# EAGLE design SmartWatch-BASIC-TOP (EAGLE 9.6.2)
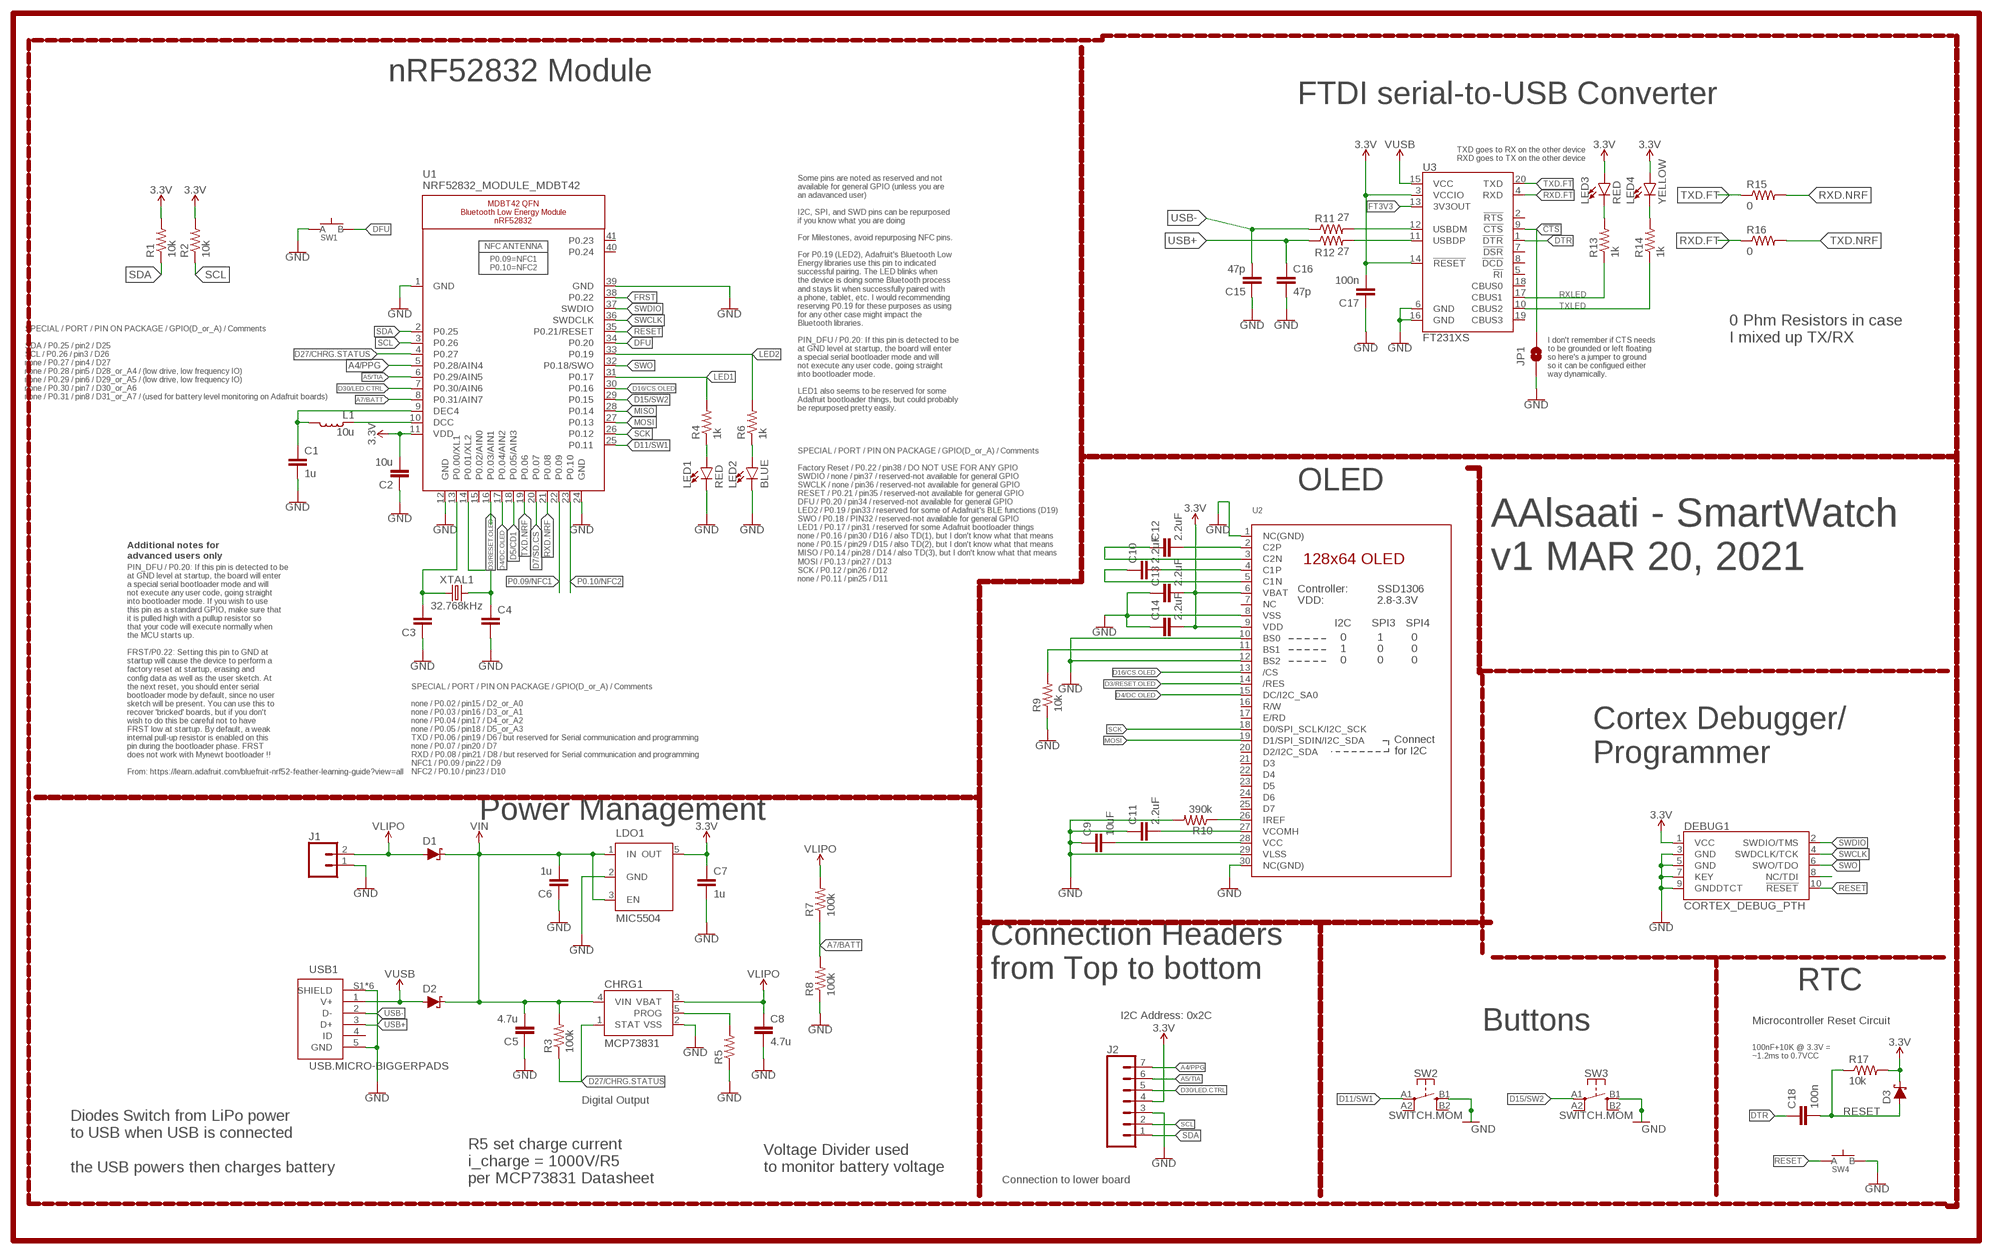
[diagram p0: schematic, sheet 1]

## Parts
C1  1u  CAPACITOR0603  [C0603]
C2  10u  CAPACITOR0805  [C0805]
C3  CAPACITOR0603  [C0603]
C4  CAPACITOR0603  [C0603]
C5  4.7u  CAPACITOR0603  [C0603]
C6  1u  CAPACITOR0603  [C0603]
C7  1u  CAPACITOR0603  [C0603]
C8  4.7u  CAPACITOR0603  [C0603]
C9  10uF  CAPACITOR0603  [C0603]
C10  2.2uF  CAPACITOR0402  [C0402]
C11  2.2uF  CAPACITOR0603  [C0603]
C12  2.2uF  CAPACITOR0402  [C0402]
C13  2.2uF  CAPACITOR0402  [C0402]
C14  2.2uF  CAPACITOR0402  [C0402]
C15  47p  CAPACITOR0603  [C0603]
C16  47p  CAPACITOR0603  [C0603]
C17  100n  CAPACITOR0603  [C0603]
C18  100n  CAPACITOR0603  [C0603]
CHRG1  MCP73831  [SOT23-5]
D1  SCHOTTKY-USC  [USC]
D2  SCHOTTKY-USC  [USC]
D3  SCHOTTKY-USC  [USC]
DEBUG1  CORTEX_DEBUG_PTH  [2X5-PTH-1.27MM]
J1  CONN_02  [1X02]
J2  CONN_07-1.27MM  [1X07_1.27MM]
JP1  JUMPER-SMT_2_NO_SILK  [SMT-JUMPER_2_NO_SILK]
L1  10u  INDUCTOR0603  [L0603]
LDO1  MIC5504  [SOT23-5]
LED1  RED  LED0603  [LED-0603]
LED2  BLUE  LED0603  [LED-0603]
LED3  RED  LED0603  [LED-0603]
LED4  YELLOW  LED0603  [LED-0603]
R1  10k  RESISTOR0603  [R0603]
R2  10k  RESISTOR0603  [R0603]
R3  100k  RESISTOR0603  [R0603]
R4  1k  RESISTOR0603  [R0603]
R5  RESISTOR0603  [R0603]
R6  1k  RESISTOR0603  [R0603]
R7  100k  RESISTOR0603  [R0603]
R8  100k  RESISTOR0603  [R0603]
R9  10k  RESISTOR0603  [R0603]
R10  390k  RESISTOR0603  [R0603]
R11  27  RESISTOR0603  [R0603]
R12  27  RESISTOR0603  [R0603]
R13  1k  RESISTOR0603  [R0603]
R14  1k  RESISTOR0603  [R0603]
R15  0  RESISTOR0603  [R0603]
R16  0  RESISTOR0603  [R0603]
R17  10k  RESISTOR0603  [R0603]
SW1  SPST-PTS830GG140-COPY.1-3  [BUTTON-GULLWING]
SW2  SWITCH.MOM  [TACTILE_SWITCH_SMD_6.2MM_TALL]
SW3  SWITCH.MOM  [TACTILE_SWITCH_SMD_6.2MM_TALL]
SW4  SPST-PTS830GG140-COPY.1-3  [BUTTON-GULLWING]
U1  NRF52832_MODULE_MDBT42  [BLE_MODULE_RAYTAC_MDBT42]
U2  DISP_OLED_UG-2864HSWEG01-NO-WRAPAROUND  [UG-2864HSWEG01_0.96IN_NO-WRAPAROUND]
U3  FT231XS  [SSOP20_L]
USB1  USB.MICRO-BIGGERPADS  [USB-MICRO-01.BIGGERPADS]
XTAL1  32.768kHz  CRYSTALECS-.327-12.5-12-C-TR  [2-SMD.NOLEAD.2.0MMTO1.2MM]

## Nets
3.3V: C2.2 C7.1 C13.2 C14.2 C17.2 D3.-(C) DEBUG1.1(VCC) J2.4 LDO1.5(OUT) LED3.A LED4.A R1.2 R2.2 R17.2 U1.11(VDD) U2.6(VBAT) U2.9(VDD) U3.3(VCCIO) U3.14(!RESET)
!CTS: JP1.2 U3.9(!CTS)
A4/PPG: J2.7 U1.5(P0.28/AIN4)
A5/TIA: J2.6 U1.6(P0.29/AIN5)
A7/BATT: R7.1 R8.2 U1.8(P0.31/AIN7)
D3/RESET.OLED: U1.16(P0.03/AIN1) U2.14(/RES)
D4/DC.OLED: U1.17(P0.04/AIN2) U2.15(DC/I2C_SA0)
D5/CD1: U1.18(P0.05/AIN3)
D7/SD.CS: U1.20(P0.07)
D11/SW1: SW2.A1 U1.25(P0.11)
D15/SW2: SW3.A1 U1.29(P0.15)
D16/CS.OLED: U1.30(P0.16) U2.13(/CS)
D27/CHRG.STATUS: CHRG1.1(STAT) R3.1 U1.4(P0.27)
D30/LED.CTRL: J2.5 U1.7(P0.30/AIN6)
DFU: SW1.3(B) U1.34(P0.20)
DTR: C18.1 U3.1(!DTR)
FRST: U1.38(P0.22)
FT3V3: U3.13(3V3OUT)
GND: C1.2 C2.1 C3.1 C4.2 C5.1 C6.1 C7.2 C8.2 C9.1 C11.1 C13.1 C14.1 C15.1 C16.2 C17.1 CHRG1.2(VSS) DEBUG1.3(GND) DEBUG1.5(GND) DEBUG1.7(KEY) DEBUG1.9(GNDDTCT) J1.1 J2.3 JP1.1 LDO1.2(GND) LED1.C LED2.C R5.1 R8.1 R9.1 R10.2 SW1.1(A) SW2.B1 SW3.B1 SW4.3(B) U1.1(GND) U1.12(GND) U1.24(GND) U1.39(GND) U2.1(NC(GND)) U2.8(VSS) U2.10(BS0) U2.12(BS2) U2.29(VLSS) U2.30(NC(GND)) U3.6(GND) U3.16(GND) USB1.5(GND) USB1.S1(SHIELD) USB1.S2(SHIELD) USB1.S3(SHIELD) USB1.S4(SHIELD) USB1.S5(SHIELD) USB1.S6(SHIELD)
LED1: R4.2 U1.31(P0.17)
LED2: R6.2 U1.33(P0.19)
MISO: U1.28(P0.14)
MOSI: U1.27(P0.13) U2.19(D1/SPI_SDIN/I2C_SDA)
N$1: R9.2 U2.11(BS1)
N$2: R10.1 U2.26(IREF)
N$3: C12.2 U2.2(C2P)
N$4: C3.2 U1.13(P0.00/XL1) XTAL1.P$1
N$5: C12.1 U2.3(C2N)
N$6: C4.1 U1.14(P0.01/XL2) XTAL1.P$2
N$7: C10.2 U2.4(C1P)
N$8: C10.1 U2.5(C1N)
N$9: LED1.A R4.1
N$10: LED2.A R6.1
N$11: L1.1 U1.10(DCC)
N$12: C1.1 L1.2 U1.9(DEC4)
N$13: C9.2 U2.28(VCC)
N$14: DEBUG1.8(NC/TDI)
N$15: C11.2 U2.27(VCOMH)
N$16: CHRG1.5(PROG) R5.2
N$23: R11.2 U3.12(USBDM)
N$24: R12.2 U3.11(USBDP)
N$25: LED3.C R13.2
N$26: LED4.C R14.2
P0.09/NFC1: U1.22(P0.09)
P0.10/NFC2: U1.23(P0.10)
RESET: C18.2 D3.+(A) DEBUG1.10(!RESET) R17.1 SW4.1(A) U1.35(P0.21/RESET)
RXD.FT: R16.1 U3.4(RXD)
RXD.NRF: R15.2 U1.21(P0.08)
RXLED: R13.1 U3.17(CBUS1)
SCK: U1.26(P0.12) U2.18(D0/SPI_SCLK/I2C_SCK)
SCL: J2.2 R2.1 U1.3(P0.26)
SDA: J2.1 R1.1 U1.2(P0.25)
SWCLK: DEBUG1.4(SWDCLK/TCK) U1.36(SWDCLK)
SWDIO: DEBUG1.2(SWDIO/TMS) U1.37(SWDIO)
SWO: DEBUG1.6(SWO/TDO) U1.32(P0.18/SWO)
TXD.FT: R15.1 U3.20(TXD)
TXD.NRF: R16.2 U1.19(P0.06)
TXLED: R14.1 U3.10(CBUS2)
USB+: C16.1 R12.1 USB1.3(D+)
USB-: C15.2 R11.1 USB1.2(D-)
V_USB: D2.+(A) U3.15(VCC) USB1.1(V+) ; supply symbol labelled VUSB
VIN: C5.2 C6.2 CHRG1.4(VIN) D1.-(C) D2.-(C) LDO1.1(IN) LDO1.3(EN) R3.2
VLIPO: C8.1 CHRG1.3(VBAT) D1.+(A) J1.2 R7.2
Unconnected: SW2.A2 SW2.B2 SW3.A2 SW3.B2 U1.15(P0.02/AIN0) U1.40(P0.24) U1.41(P0.23) U2.7(NC) U2.16(R/W) U2.17(E/RD) U2.20(D2/I2C_SDA) U2.21(D3) U2.22(D4) U2.23(D5) U2.24(D6) U2.25(D7) U3.2(!RTS) U3.5(!RI) U3.7(!DSR) U3.8(!DCD) U3.18(CBUS0) U3.19(CBUS3) USB1.4(ID)

## Notes on the sheet
- nRF52832 Module
- FTDI serial-to-USB Converter
- TXD goes to RX on the other device
  RXD goes to TX on the other device
- 0 Phm Resistors in case 
  I mixed up TX/RX
- I don't remember if CTS needs
  to be grounded or left floating
  so here's a jumper to ground
  so it can be configued either
  way dynamically.
- SPECIAL / PORT / PIN ON PACKAGE / GPIO(D_or_A) / Comments
  
  SDA / P0.25 / pin2 / D25
  SCL / P0.26 / pin3 / D26
  none / P0.27 / pin4 / D27
  none / P0.28 / pin5 / D28_or_A4 / (low drive, low frequency IO)
  none / P0.29 / pin6 / D29_or_A5 / (low drive, low frequency IO)
  none / P0.30 / pin7 / D30_or_A6
  none / P0.31 / pin8 / D31_or_A7 / (used for battery level monitoring on Adafruit boards)
- Some pins are noted as reserved and not
  available for general GPIO (unless you are
  an adavanced user)
  
  I2C, SPI, and SWD pins can be repurposed
  if you know what you are doing
  
  For Milestones, avoid repurposing NFC pins.
  
  For P0.19 (LED2), Adafruit's Bluetooth Low
  Energy libraries use this pin to indicated
  successful pairing. The LED blinks when
  the device is doing some Bluetooth process
  and stays lit when successfully paired with
  a phone, tablet, etc. I would recommending
  reserving P0.19 for these purposes as using
  for any other case might impact the
  Bluetooth libraries.
  
  PIN_DFU / P0.20: If this pin is detected to be
  at GND level at startup, the board will enter
  a special serial bootloader mode and will
  not execute any user code, going straight
  into bootloader mode.
  
  LED1 also seems to be reserved for some
  Adafruit bootloader things, but could probably
  be repurposed pretty easily.
- OLED
- Additional notes for
  advanced users only
- AAlsaati - SmartWatch 
  v1 MAR 20, 2021
- SPECIAL / PORT / PIN ON PACKAGE / GPIO(D_or_A) / Comments
  
  Factory Reset / P0.22 / pin38 / DO NOT USE FOR ANY GPIO
  SWDIO / none / pin37 / reserved-not available for general GPIO
  SWCLK / none / pin36 / reserved-not available for general GPIO
  RESET / P0.21 / pin35 / reserved-not available for general GPIO
  DFU / P0.20 / pin34 / reserved-not available for general GPIO
  LED2 / P0.19 / pin33 / reserved for some of Adafruit's BLE functions (D19)
  SWO / P0.18 / PIN32 / reserved-not available for general GPIO
  LED1 / P0.17 / pin31 / reserved for some Adafruit bootloader things
  none / P0.16 / pin30 / D16 / also TD(1), but I don't know what that means
  none / P0.15 / pin29 / D15 / also TD(2), but I don't know what that means
  MISO / P0.14 / pin28 / D14 / also TD(3), but I don't know what that means
  MOSI / P0.13 / pin27 / D13
  SCK / P0.12 / pin26 / D12
  none / P0.11 / pin25 / D11
- Cortex Debugger/
  Programmer
- PIN_DFU / P0.20: If this pin is detected to be
  at GND level at startup, the board will enter
  a special serial bootloader mode and will
  not execute any user code, going straight
  into bootloader mode. If you wish to use
  this pin as a standard GPIO, make sure that
  it is pulled high with a pullup resistor so
  that your code will execute normally when
  the MCU starts up.
  
  FRST/P0.22: Setting this pin to GND at
  startup will cause the device to perform a
  factory reset at startup, erasing and
  config data as well as the user sketch. At
  the next reset, you should enter serial
  bootloader mode by default, since no user
  sketch will be present. You can use this to
  recover 'bricked' boards, but if you don't
  wish to do this be careful not to have
  FRST low at startup. By default, a weak
  internal pull-up resistor is enabled on this
  pin during the bootloader phase. FRST
  does not work with Mynewt bootloader !!
  
  From: https://learn.adafruit.com/bluefruit-nrf52-feather-learning-guide?view=all
- SPECIAL / PORT / PIN ON PACKAGE / GPIO(D_or_A) / Comments
  
  none / P0.02 / pin15 / D2_or_A0
  none / P0.03 / pin16 / D3_or_A1
  none / P0.04 / pin17 / D4_or_A2
  none / P0.05 / pin18 / D5_or_A3
  TXD / P0.06 / pin19 / D6 / but reserved for Serial communication and programming
  none / P0.07 / pin20 / D7
  RXD / P0.08 / pin21 / D8 / but reserved for Serial communication and programming
  NFC1 / P0.09 / pin22 / D9
  NFC2 / P0.10 / pin23 / D10
- Power Management
- Connection Headers
  from Top to bottom
- RTC
- I2C Address: 0x2C
- Microcontroller Reset Circuit
- Buttons
- 100nF+10K @ 3.3V =
  ~1.2ms to 0.7VCC
- Digital Output
- Diodes Switch from LiPo power 
  to USB when USB is connected
  
  the USB powers then charges battery
- Voltage Divider used 
  to monitor battery voltage
- R5 set charge current
  i_charge = 1000V/R5
  per MCP73831 Datasheet
- Connection to lower board

## Library data of the parts
C1-C18 = LinnesLab-Passives:CAPACITOR
CHRG1 = LinnesLab-Power:MCP73831: MCP73831T Li-Ion, Li-Pol Controller Miniature single cell, fully integrated Li-Ion, Li-polymer charge management controller Datasheet <http://ww1.microchip.com/downloads/en/DeviceDoc/20001984g.pdf> SparkFun Products: SparkFun ESP32 Thing <https://www.sparkfun.com/products/13907> SparkFun 9DoF Razor IMU M0 <https://www.sparkfun.com/products/14001>; PROD_ID: IC-09995
D1-D3 = LinnesLab-DiscreteSemi:SCHOTTKY: Schottky diode A Schottky diode is a semiconductor diode which has a low forward voltage drop and a very fast switching action. Example: Digi-Key Part Number: RB161MM-20CT-ND
DEBUG1 = LinnesLab-Connectors:CORTEX_DEBUG: Cortex Debug Connector - 10 pin Supports JTAG debug, Serial Wire debug, and Serial Wire Viewer. PTH and SMD connector options available. General Connector Information <http://infocenter.arm.com/help/topic/com.arm.doc.faqs/attached/13634/cortex_debug_connectors.pdf> Products: PTH Connector <http://www.digikey.com/product-detail/en/cnc-tech/3220-10-0100-00/1175-1627-ND/3883661> -via Digi-Key SparkFun PSoc <https://www.sparkfun.com/products/13229> SparkFun T <https://www.sparkfun.com/products/13810>
J1 = LinnesLab-Connectors:CONN_02: Multi connection point. Often used as Generic Header-pin footprint for 0.1 inch spaced/style header connections On any of the 0.1 inch spaced packages, you can populate with these: Break Away Headers - Straight <https://www.sparkfun.com/products/116> (PRT-00116) Break Away Male Headers - Right Angle <https://www.sparkfun.com/products/553> (PRT-00553) Female Headers <https://www.sparkfun.com/products/115> (PRT-00115) Break Away Headers - Machine Pin <https://www.sparkfun.com/products/117> (PRT-00117) Break Away Female Headers - Swiss Machine Pin <https://www.sparkfun.com/products/743> (PRT-00743) For SCREWTERMINALS and SPRING TERMINALS visit here: Screw Terimnals on SparkFun.com <https://www.sparkfun.com/search/results?term=Screw+Terminals> (5mm/3.5mm/2.54mm spacing) This device is also useful as a general connection point to wire up your design to another part of your project. Our various solder wires solder well into these plated through hole pads. Hook-Up Wire - Assortment (Stranded, 22 AWG) <https://www.sparkfun.com/products/11375> (PRT-11375) Hook-Up Wire - Assortment (Solid Core, 22 AWG) <https://www.sparkfun.com/products/11367> (PRT-11367) View the entire wire category on our website here <https://www.sparkfun.com/categories/141> Special notes: Molex polarized connector foot print use with: PRT-08233 with associated crimp pins and housings. 2.54_SCREWTERM for use with PRT-10571. 3.5mm Screw Terminal footprints for PRT-08084 5mm Screw Terminal footprints for use with PRT-08432
J2 = LinnesLab-Connectors:CONN_07: Multi connection point. Often used as Generic Header-pin footprint for 0.1 inch spaced/style header connections On any of the 0.1 inch spaced packages, you can populate with these: Break Away Headers - Straight <https://www.sparkfun.com/products/116> (PRT-00116) Break Away Male Headers - Right Angle <https://www.sparkfun.com/products/553> (PRT-00553) Female Headers <https://www.sparkfun.com/products/115> (PRT-00115) Break Away Headers - Machine Pin <https://www.sparkfun.com/products/117> (PRT-00117) Break Away Female Headers - Swiss Machine Pin <https://www.sparkfun.com/products/743> (PRT-00743) For SCREWTERMINALS and SPRING TERMINALS visit here: Screw Terimnals on SparkFun.com <https://www.sparkfun.com/search/results?term=Screw+Terminals> (5mm/3.5mm/2.54mm spacing) This device is also useful as a general connection point to wire up your design to another part of your project. Our various solder wires solder well into these plated through hole pads. Hook-Up Wire - Assortment (Stranded, 22 AWG) <https://www.sparkfun.com/products/11375> (PRT-11375) Hook-Up Wire - Assortment (Solid Core, 22 AWG) <https://www.sparkfun.com/products/11367> (PRT-11367) View the entire wire category on our website here <https://www.sparkfun.com/categories/141> Special notes: Molex polarized connector foot print use with SKU : PRT-08231 with associated crimp pins and housings. 1MM SMD Version SKU: PRT-10208 NOTES ON THE VARIANTS LOCK and LOCK_LONGPADS... This footprint was designed to help hold the alignment of a through-hole component (i.e. 6-pin header) while soldering it into place. You may notice that each hole has been shifted either up or down by 0.005 of an inch from it's more standard position (which is a perfectly straight line). This slight alteration caused the pins (the squares in the middle) to touch the edges of the holes. Because they are alternating, it causes a "brace" to hold the component in place. 0.005 has proven to be the perfect amount of "off-center" position when using our standard breakaway headers. Although looks a little odd when you look at the bare footprint, once you have a header in there, the alteration is very hard to notice. Also,if you push a header all the way into place, it is covered up entirely on the bottom side.
JP1 = LinnesLab-Switches:JUMPER-SMT_2_NO: Normally open jumper This jumper has two pads in close proximity to each other. Apply solder to close the connection. Round pads are easier to solder for beginners, but are a lot larger. SparkFun Product that uses the round pads: SparkFun EL Sequencer <https://www.sparkfun.com/products/12781>
L1 = LinnesLab-Passives:INDUCTOR
LDO1 = LinnesLab-Power:MIC5504: MIC5504 Voltage Regulator Output Voltages: 1.0V to 3.3V Input Voltages: 2.5V to 5.5V Link to Datasheet http://ww1.microchip.com/downloads/en/DeviceDoc/MIC550X.pdf
LED1-LED4 = LinnesLab-LED:LED: LED (Generic) Standard schematic elements and footprints for 5mm, 3mm, 1206, and 0603 sized LEDs. Generic LEDs with no color specified. LTST-C190KGKT: arrow indicates cathode
R1-R17 = LinnesLab-Passives:RESISTOR
SW1 SW4 = LinnesLab-Switches:SPST-PTS830GG140-COPY
SW2 SW3 = LinnesLab-Switches:SWITCH.MOM: PTS645SM43SMTR92 LFS
U1 = LinnesLab-Microcontrollers:NRF52832_MODULE_MDBT42: MDBT42 - BLE Module (nRF52832 QFN) VDD: 1.7-3.6V
U2 = LinnesLab-Displays:DISP_OLED_UG-2864HSWEG01: UG-2864HSWEG01 OLED display Both 1.3" and 0.96" models share the same FPC tab footprint, only the screen dimensions vary.
U3 = LinnesLab-DigitalIC:FT231X: FTDI FT231X Full Speed USB to Full-handshake UART This USB2.0 Full Speed IC offers a compact bridge to full handshake UART interfaces. The device is a UART, capable of operating up to 3MBaud, with low power consumption (8mA). The FT231X includes the complete FT-X series feature set and enables USB to be added into a system design quickly and easily over a UART interface. Datasheet <http://cdn.sparkfun.com/datasheets/Components/General%20IC/DS_FT231X.pdf>; DIGIKEY: 768-1156-5-ND; MFN: FT231XS-U
USB1 = LinnesLab-Connectors:USB.MICRO: DigiKey PN: 609-4613-1-ND
XTAL1 = LinnesLab-Clocks:CRYSTAL; DIGIKEY: XC2288CT-ND; FREQ: 32.7680KHZ; LOAD_CAP: 12.5pF

## Board
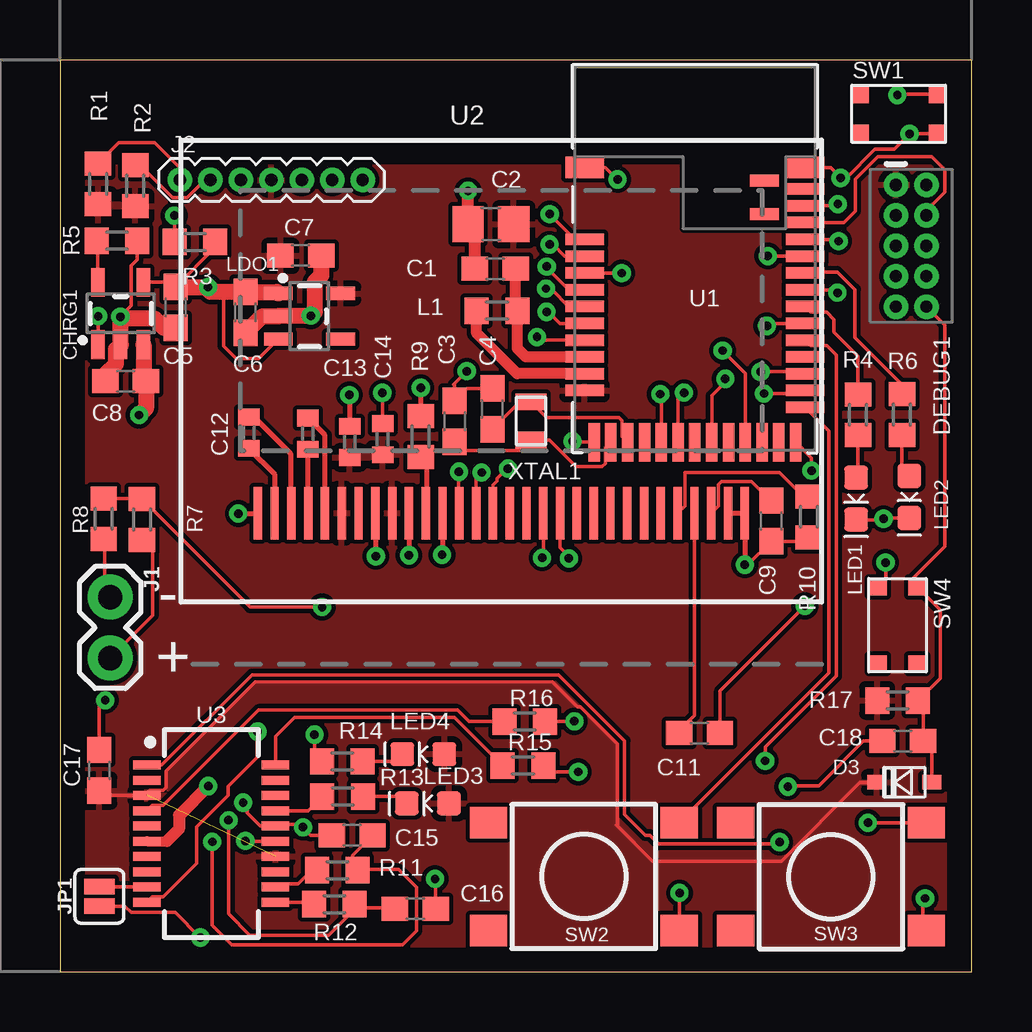
[diagram p1: board, top side]
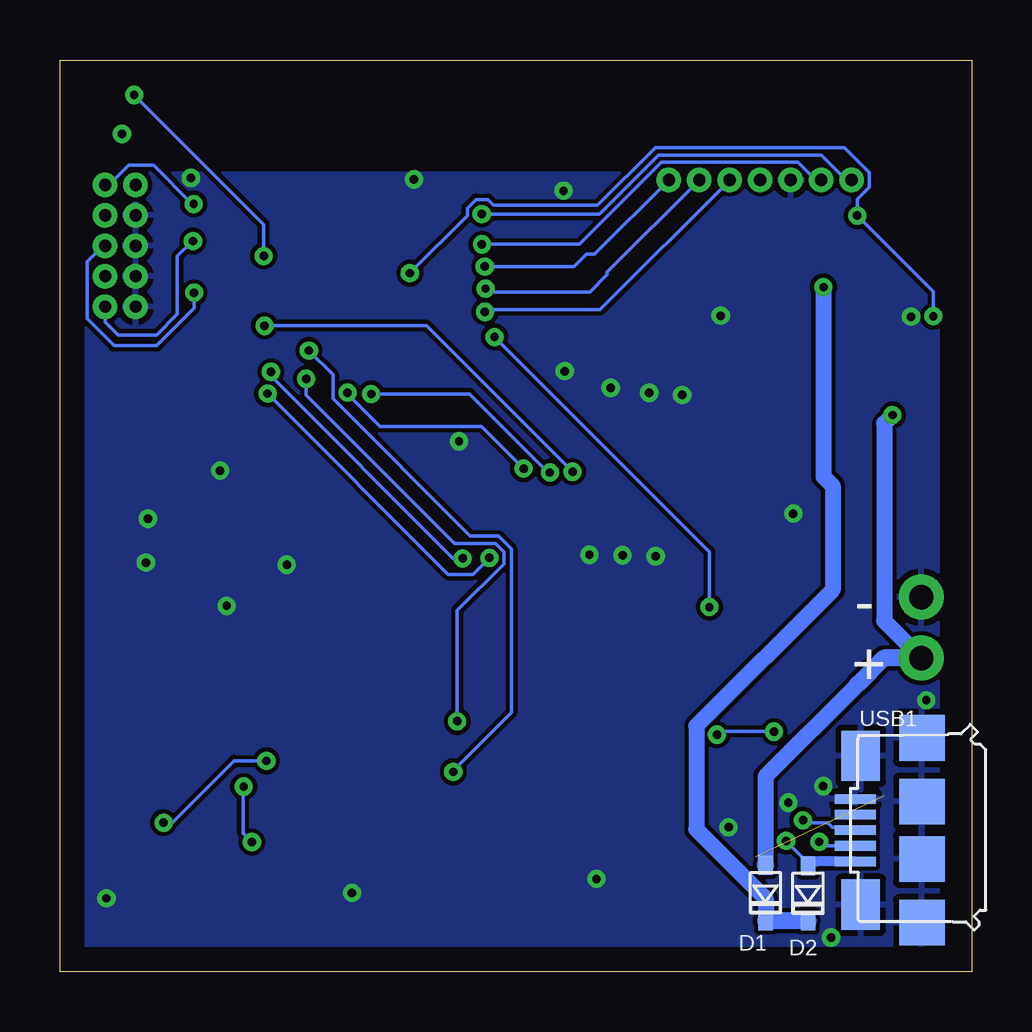
[diagram p2: board, bottom side, seen from below]

Size 38 x 38 mm. Coordinates in mm from the lower left corner, seen from the top.
Outline: 0,0 38,0 38,38 0,38 0,0
Copper layers (1*16): Top 0.035mm / dielectric 1.5mm / Bottom 0.035mm
Design rules "default": minimum track width 6mil, minimum drill 0.35mm, track to track 6mil, track to pad 6mil, pad to pad 6mil, via to via 6mil, smd to smd 6mil, copper to edge 40mil, drill to drill 6mil, minimum pad ring 10mil, minimum via ring 8mil, stop-mask expansion 4mil, vias tented up to drill 0mil, thermal gap 10mil

### Footprints (pad centres in the part's own frame; a part is rotated, then mirrored left to right if it is on the bottom)
C0603 = smd 1.1 x 1: 1 -0.85,0; 2 0.85,0
C0805 = smd 1.3 x 1.5: 1 -0.95,0; 2 0.95,0
C0402 = smd 0.7 x 0.9: 1 -0.65,0; 2 0.65,0
SOT23-5 = smd 0.55 x 1.2: 1 -0.95,-1.3; 2 0,-1.3; 3 0.95,-1.3; 4 0.95,1.3; 5 -0.95,1.3
USC = smd 0.8 x 0.6: + -1.15,0; - 1.15,0
2X5-PTH-1.27MM = drill 0.508 pad 1: 1 -2.54,-0.635; 2 -2.54,0.635; 3 -1.27,-0.635; 4 -1.27,0.635; 5 0,-0.635; 6 0,0.635; 7 1.27,-0.635; 8 1.27,0.635; 9 2.54,-0.635; 10 2.54,0.635
1X02 = drill 1.016 pad 1.88: 1 0,0; 2 2.54,0
1X07_1.27MM = drill 0.508 pad 1: 1 0,0; 2 1.27,0; 3 2.54,0; 4 3.81,0; 5 5.08,0; 6 6.35,0; 7 7.62,0
SMT-JUMPER_2_NO_SILK = smd 0.635 x 1.27: 1 -0.406,0; 2 0.406,0
L0603 = smd 1 x 1.1: 1 -0.85,0; 2 0.85,0
LED-0603 = smd 1 x 1: A -0.877,0; C 0.877,0
R0603 = smd 1 x 1.1: 1 -0.85,0; 2 0.85,0
BUTTON-GULLWING = smd 0.7 x 0.75: 1 -1.6,0.825; 2 1.6,0.825; 3 -1.6,-0.825; 4 1.6,-0.825
TACTILE_SWITCH_SMD_6.2MM_TALL = smd 1.55 x 1.3: A1 -3.975,-2.25; A2 3.975,-2.25; B1 -3.975,2.25; B2 3.975,2.25
BLE_MODULE_RAYTAC_MDBT42 = smd 1.6 x 0.9: 1 -4.6,3.8; 39 4.6,3.8 | smd 1.6 x 0.48: 2 -4.6,0.8; 3 -4.6,0.1; 4 -4.6,-0.6; 5 -4.6,-1.3; 6 -4.6,-2; 7 -4.6,-2.7; 8 -4.6,-3.4; 9 -4.6,-4.1; 10 -4.6,-4.8; 11 -4.6,-5.5; 25 4.6,-6.2; 26 4.6,-5.5; 27 4.6,-4.8; 28 4.6,-4.1; 29 4.6,-3.4; 30 4.6,-2.7; 31 4.6,-2; 32 4.6,-1.3; 33 4.6,-0.6; 34 4.6,0.1; 35 4.6,0.8; 36 4.6,1.5; 37 4.6,2.2; 38 4.6,2.9 | smd 0.48 x 1.6: 12 -4.2,-7.65; 13 -3.5,-7.65; 14 -2.8,-7.65; 15 -2.1,-7.65; 16 -1.4,-7.65; 17 -0.7,-7.65; 18 0,-7.65; 19 0.7,-7.65; 20 1.4,-7.65; 21 2.1,-7.65; 22 2.8,-7.65; 23 3.5,-7.65; 24 4.2,-7.65 | smd 1.2 x 0.5: 40 2.9,3.25; 41 2.9,1.85
UG-2864HSWEG01_0.96IN_NO-WRAPAROUND = smd 0.35 x 2.2: 1 -10.15,-1.2; 2 -9.45,-1.2; 3 -8.75,-1.2; 4 -8.05,-1.2; 5 -7.35,-1.2; 6 -6.65,-1.2; 7 -5.95,-1.2; 8 -5.25,-1.2; 9 -4.55,-1.2; 10 -3.85,-1.2; 11 -3.15,-1.2; 12 -2.45,-1.2; 13 -1.75,-1.2; 14 -1.05,-1.2; 15 -0.35,-1.2; 16 0.35,-1.2; 17 1.05,-1.2; 18 1.75,-1.2; 19 2.45,-1.2; 20 3.15,-1.2; 21 3.85,-1.2; 22 4.55,-1.2; 23 5.25,-1.2; 24 5.95,-1.2; 25 6.65,-1.2; 26 7.35,-1.2; 27 8.05,-1.2; 28 8.75,-1.2; 29 9.45,-1.2; 30 10.15,-1.2
SSOP20_L = smd 0.381 x 1.143: 1 -2.857,-2.68; 2 -2.223,-2.68; 3 -1.587,-2.68; 4 -0.953,-2.68; 5 -0.318,-2.68; 6 0.318,-2.68; 7 0.953,-2.68; 8 1.587,-2.68; 9 2.223,-2.68; 10 2.857,-2.68; 11 2.857,2.68; 12 2.223,2.68; 13 1.587,2.68; 14 0.953,2.68; 15 0.318,2.68; 16 -0.318,2.68; 17 -0.953,2.68; 18 -1.587,2.68; 19 -2.223,2.68; 20 -2.857,2.68
USB-MICRO-01.BIGGERPADS = smd 0.4 x 1.7: 1 -1.3,1.505; 2 -0.65,1.505; 3 0,1.505; 4 0.65,1.505; 5 1.3,1.505 | smd 1.9 x 1.9: S1 -3.85,-1.27; S2 -1.2,-1.27; S3 1.2,-1.27; S4 3.85,-1.27 | smd 2.1 x 1.6: S5 -3.1,1.28; S6 3.1,1.28
2-SMD.NOLEAD.2.0MMTO1.2MM = smd 0.7 x 1.3: P$1 -0.8,0; P$2 0.8,0

### Placement (x,y rotation side)
C1  18.15,29.29 180 top
C2  17.96,31.15 0 top
C3  16.44,22.94 270 top
C4  18.03,23.45 90 top
C5  4.83,27.69 90 top
C6  7.74,27.48 90 top
C7  10.04,29.84 0 top
C8  2.74,24.62 180 top
C9  29.65,18.79 90 top
C10  10.34,22.42 270 top
C11  26.66,9.94 180 top
C12  7.87,22.46 270 top
C13  12.08,22.08 270 top
C14  13.45,22.19 270 top
C15  12.18,5.67 0 top
C16  14.81,2.62 0 top
C17  1.64,8.39 270 top
C18  35.13,9.61 0 top
CHRG1  2.53,27.43 0 top
D1  8.59,3.28 270 bottom
D2  6.82,3.26 270 bottom
D3  35.2,7.89 180 top
DEBUG1  35.48,30.25 270 top
J1  2.1,15.61 270 top
J2  5,33 0 top
JP1  1.64,3.13 90 top
L1  18.21,27.54 0 top
LDO1  10.4,27.32 270 top
LED1  33.19,19.72 270 top
LED2  35.41,19.78 270 top
LED3  15.34,7.01 180 top
LED4  15.14,9.06 180 top
R1  1.59,32.84 270 top
R2  3.14,32.76 270 top
R3  5.63,30.41 0 top
R4  33.27,23.21 90 top
R5  2.38,30.46 180 top
R6  35.1,23.22 90 top
R7  3.42,18.84 270 top
R8  1.82,18.88 90 top
R9  15.04,22.3 270 top
R10  31.22,18.95 270 top
R11  11.56,4.22 180 top
R12  11.44,2.81 180 top
R13  11.79,7.3 0 top
R14  11.77,8.76 0 top
R15  19.31,8.59 0 top
R16  19.37,10.42 0 top
R17  34.92,11.3 180 top
SW1  34.97,35.76 180 top
SW2  21.84,3.96 180 top
SW3  32.14,3.95 180 top
SW4  34.91,14.44 270 top
U1  26.47,29.72 0 top
U2  18.4,20.3 0 top
U3  6.31,5.75 270 top
USB1  3.34,5.89 90 bottom
XTAL1  19.64,22.95 90 top

### Tracks (layer width: path | path; a pad name or v marks a point on that pad's centre or on a via)
3.3V  (1 unrouted)
  Top 0.152: U3.3 3.52,7.34 | 3.52,7.34 1.85,7.34 C17.2 | D3.- 33.35,7.89 30.06,4.6 24.7,4.6 23.23,6.07 | 23.23,6.07 23.19,6.11 | 3.52,7.34 3.74,7.55 4.29,7.55 4.43,7.69 4.43,8.36 8.14,12.06 20.54,12.06 21.57,11.04 21.69,11.04 23.23,9.5 23.23,6.07
  pour Top (isolate 0.178): 1.25,33.57 37.75,33.57 37.75,0.35 0.93,0.35 0.93,32.29
!CTS
  Top 0.152: JP1.2 1.66,3.53 U3.9
A4/PPG  (via drill 0.35)
  Top 0.152: U1.5 21.19,28.42 20.3,29.31 v20.3,29.39
  Bottom 0.152: J2.7 15.72,29.9 16.05,29.9 16.57,29.39 v20.3,29.39
A5/TIA  (via drill 0.35)
  Top 0.152: U1.6 21.2,27.72 20.52,28.4 20.5,28.38 20.35,28.38 v20.26,28.47
  Bottom 0.152: J2.6 15.2,29.15 15.2,29.05 15.91,28.33 20.12,28.33 v20.26,28.47
A7/BATT  (via drill 0.35)
  Top 0.152: U1.8 20.02,26.32 v19.89,26.45 | v10.93,15.19 7.92,15.19 R7.1 3.38,19.73 R8.2
  Bottom 0.152: v19.89,26.45 10.93,17.5 v10.93,15.19
D3/RESET.OLED  (via drill 0.35)
  Top 0.152: U2.14 17.35,20.57 v17.57,20.8 | v25.03,24.07 25.07,24.03 U1.16
  Bottom 0.152: v17.57,20.8 17.61,20.76 20.93,24.07 v25.03,24.07
D4/DC.OLED  (via drill 0.35)
  Top 0.152: U2.15 18.05,20.27 18.22,20.45 18.22,20.56 18.65,20.99 v18.67,20.96 | v26.02,24.13 25.77,23.88 U1.17
  Bottom 0.152: v26.02,24.13 26.02,24.07 24.67,22.72 20.43,22.72 v18.67,20.96
D11/SW1
  Top 0.152: SW2.A1 32.05,12.45 32.05,22.54 U1.25
D15/SW2  (via drill 0.35)
  Top 0.152: SW3.A1 v33.68,6.21 | U1.29 31.3,26.09 31.96,26.09 32.35,25.7 32.35,12.32 29.4,9.36 v29.4,8.78
  Bottom 0.152: v33.68,6.21 33.32,6.21 30.74,8.78 v29.4,8.78
D16/CS.OLED  (via drill 0.35)
  Top 0.152: U2.13 16.61,19.14 16.61,20.82 v16.63,20.84 | v29.47,26.92 29.57,27.02 U1.30
  Bottom 0.152: v16.63,20.84 22.71,26.92 v29.47,26.92
D27/CHRG.STATUS  (via drill 0.35)
  Top 0.152: R3.1 4.78,31.5 v4.76,31.51 | v1.59,27.32 1.59,26.14 CHRG1.1 | U1.4 v23.41,29.12 v23.42,29.11
  Bottom 0.152: v1.59,27.32 1.59,28.35 v4.76,31.51 4.76,32.2 4.26,32.7 4.26,33.3 5.3,34.35 13.18,34.35 15.59,31.94 19.92,31.94 20.16,32.18 20.66,32.18 21.02,31.83 21.02,31.51 v23.42,29.11
D30/LED.CTRL  (via drill 0.35)
  Top 0.152: U1.7 20.85,27.02 20.37,27.5 v20.28,27.5
  Bottom 0.152: v20.28,27.5 20.2,27.59 15.49,27.59 J2.5
DFU  (via drill 0.35)
  Top 0.152: U1.34 31.06,29.83 v29.51,29.83 | v34.91,36.54 34.95,36.58 SW1.3
  Bottom 0.152: v29.51,29.83 29.51,31.14 v34.91,36.54
DTR  (via drill 0.35)
  Top 0.152: U3.1 4.25,8.61 8.01,12.37 20.79,12.37 23.54,9.62 23.54,6.55 24.4,5.68 24.6,5.68 24.95,5.33 30.07,5.33 v30,5.39 | v30.34,7.71 30.38,7.75 31.63,7.75 33.49,9.61 C18.1
  Bottom 0.152: v30,5.39 30.36,5.76 30.36,7.69 v30.34,7.71
GND  (via drill 0.35)
  Top 0.152: R8.1 1.86,17.99 1.86,15.85 J1.1 | C4.2 16.96,24.3 C3.1 16.44,24.45 16.41,24.48 v16.96,25.02 | U1.12 21.37,22.07 v21.37,22.11 | R10.2 31.05,17.94 C9.1 28.67,16.96 v28.55,16.96 | 35.35,18.85 LED2.C 35.4,18.9 34.33,18.9 v34.33,18.87 34.21,18.87 34.17,18.83 33.2,18.83 LED1.C | SW3.B1 35.98,1.84 35.98,2.97 v36.06,3.05 | U1.24 31.33,21.41 v31.33,20.88 | SW1.1 v35.43,34.93 v35.42,34.92 34.77,34.27 33.97,34.27 32.77,33.08 v32.54,33.08 32.54,33.12 32.14,33.52 U1.39 | C11.1 27.51,11.7 v31.05,15.24 | SW2.B1 25.82,3.26 v25.83,3.28 | v1.89,11.31 1.64,11.06 C17.1 | v7.64,7.04 7.8,6.88 7.8,6.61 8.34,6.07 U3.16 9.06,6.14 9.97,6.14 10.1,6.01 | SW4.3 34.42,16.37 v34.42,17.05 | R5.1 3.23,29.67 2.98,29.42 2.98,27.75 v2.52,27.29 | U1.1 22.75,33.52 v23.24,33.02 | C16.2 15.66,3.83 v15.63,3.86 | C15.1 10.45,5.67 10.1,6.01 | v10.13,6.01 10.1,6.01 | C14.1 13.45,24.12 v13.45,24.13 v13.44,24.13 | JP1.1 2.71,2.73 2.96,2.47 4.79,2.47 v5.85,1.42
  Top 0.203: v12.06,24.04 12.08,24.02 C13.1 | R9.1 15.05,23.16 15.05,24.35 v15.04,24.33 | U2.10 14.55,17.39 14.56,17.37 v14.55,17.36 | U2.8 13.15,17.33 v13.16,17.32 | U2.12 15.95,17.39 v15.93,17.37 | U2.1 8.22,19.08 v7.44,19.08 v7.43,19.09 | U2.29 U2.30 | U2.30 28.59,19.14 | U2.30 v28.55,16.96
  Top 0.406: U3.6 4.46,5.43
  Top 0.508: v6.18,7.73 4.97,6.52 4.97,5.95 4.46,5.43 | C1.2 17.3,30.87 C2.1 v17.01,32.54 v17.01,32.55
  Top 0.66: C8.2 1.89,24.88 2.34,25.33 2.34,25.94 CHRG1.2 2.53,27.28 | 2.53,27.28 v2.52,27.29 v2.52,27.3 | C5.1 4.33,26.84 3.96,27.21 2.6,27.21 2.53,27.28 | C6.1 8.41,27.3 8.44,27.3 8.47,27.32 LDO1.2 9.12,27.34 v10.46,27.34 10.62,27.5 10.62,28.75 10.89,29.01 C7.2
  pour Bottom (isolate 0.178): 1.39,33.27 37.73,33.27 37.73,0.18 1.38,0.18 1.38,33.25
LED1
  Top 0.152: R4.2 33.27,25.65 32.27,26.65 32.27,27.18 31.96,27.49 31.3,27.49 U1.31
LED2
  Top 0.152: U1.33 31.11,29.17 32.4,29.17 33.14,28.43 33.14,26.43 35.1,24.46 R6.2
MOSI  (via drill 0.35)
  Top 0.152: U2.19 20.85,17.68 21.3,17.22 v21.21,17.22 | v29.21,25 30.99,25 U1.27
  Bottom 0.152: v21.21,17.22 21.61,17.22 29.21,24.82 v29.21,25
N$1
  Top 0.203: U2.11 15.28,19.14 15.28,21.21 R9.2
N$2
  Top 0.152: U2.26 26.04,19.4 26.04,20.8 29.99,20.8 30.98,19.8 R10.1
N$3
  Top 0.203: C12.2 8.95,20.73 U2.2
N$4
  Top 0.152: U1.13 22.73,21.84 22.73,21.18 22.6,21.04 21.51,21.04 20.4,22.15 XTAL1.P$1 19.2,21.71 16.82,21.71 C3.2
N$5
  Top 0.203: C12.1 8.1,23.11 9.61,21.6 9.61,19.14 U2.3
N$6
  Top 0.152: U1.14 23.43,22.3 23.43,22.96 23.3,23.1 20.29,23.1 XTAL1.P$2 19.17,23.75 C4.1
N$7
  Top 0.203: U2.4 C10.2
N$8
  Top 0.203: U2.5 11.05,22.36 C10.1
N$9
  Top 0.152: LED1.A 33.27,20.67 R4.1
N$10
  Top 0.152: R6.1 35.1,20.97 LED2.A
N$11
  Top 0.457: U1.10 19.06,24.92 17.36,26.61 L1.1
N$12
  Top 0.152: U1.9 21.86,25.63
  Top 0.457: U1.9 19.42,25.62 19.07,25.97 L1.2 19,27.61 C1.1
N$13
  Top 0.152: U2.28 27.44,19.4 27.44,20.3 27.58,20.43 28.82,20.43 29.61,19.64 C9.2
N$15
  Top 0.152: C11.2 25.81,10.04 26.45,10.68 U2.27
N$16
  Top 0.152: CHRG1.5 1.58,30.41 R5.2
N$23
  Top 0.152: U3.12 9.12,3.66 9.92,3.66 10.49,4.22 R11.2
N$24
  Top 0.152: U3.11 10.5,2.89 R12.2
N$25
  Top 0.152: LED3.C 14.17,7.3 R13.2
N$26
  Top 0.152: LED4.C 13.97,8.76 R14.2
RESET  (via drill 0.35)
  Top 0.152: 36.18,10.88 R17.1 | R17.1 36.69,12.22 36.69,15.08 SW4.1 35.46,16.31 36.88,17.73 36.88,26.95 DEBUG1.10 | U1.35 32.38,30.52 v32.46,30.45 | R17.1 35.98,11.08 C18.2 36.35,9.24 D3.+
  Bottom 0.152: v32.46,30.45 32.48,30.45 33.11,29.82 33.11,27.4 33.98,26.54 35.58,26.54 36.12,27.07 DEBUG1.10
RXD.FT
  Top 0.152: 18.93,10.01 R16.1 17.06,10.42 16.57,10.9 8.28,10.9 4.29,6.92 3.84,6.92 U3.4
RXD.NRF  (via drill 0.35)
  Top 0.152: U1.21 28.57,24.92 27.63,25.86 v27.63,25.89 | v21.6,8.32 20.42,8.32 R15.2
  Bottom 0.152: v27.63,25.89 26.62,24.88 26.62,23.88 20.9,18.16 19.72,18.16 19.19,17.62 19.19,10.79 21.6,8.38 v21.6,8.32
RXLED
  Top 0.152: R13.1 10.34,6.7 U3.17
SCK  (via drill 0.35)
  Top 0.152: U2.18 20.15,17.27 v20.11,17.23 v20.1,17.24 | v29.35,24.09 30.94,24.09 U1.26
  Bottom 0.152: v20.1,17.24 20.79,16.56 21.81,16.56 v29.35,24.09
SCL  (via drill 0.35)
  Top 0.152: J2.2 6.04,33 5.3,32.26 4.7,32.26 3.35,33.61 R2.1 3.22,33.61 | U1.3 21.04,29.82 20.54,30.32 v20.41,30.32
  Bottom 0.152: v20.41,30.32 16.35,30.32 12.93,33.74 7.24,33.74 6.5,33 J2.2
SDA  (via drill 0.35)
  Top 0.152: U1.2 21.47,30.52 v20.41,31.58 | R1.1 2.45,34.54 3.95,34.54 5,33.5 J2.1
  Bottom 0.152: v20.41,31.58 15.52,31.58 13.05,34.04 6.27,34.04 5.23,33 J2.1
SWCLK
  Top 0.152: DEBUG1.4 36.12,31.71 36.89,32.48 36.89,33.43 36.35,33.97 34.09,33.97 33.16,33.03 33.16,31.7 32.68,31.22 U1.36
SWDIO  (via drill 0.35)
  Top 0.152: U1.37 32.35,31.92 v32.43,32
  Bottom 0.152: DEBUG1.2 35.95,32.79 35.14,33.61 34.1,33.61 32.49,32 v32.43,32
SWO  (via drill 0.35)
  Top 0.152: U1.32 31.09,28.4 32.35,28.4 32.24,28.3 v32.41,28.3
  Bottom 0.152: v32.41,28.3 32.41,27.65 33.97,26.09 35.75,26.09 36.87,27.21 36.87,29.59 36.2,30.25 DEBUG1.6
TXD.FT
  Top 0.152: 18.33,8.46 R15.1 16.44,10.6 9.79,10.6 8.98,9.8 U3.20
TXD.NRF  (via drill 0.35)
  Top 0.152: U1.19 27.17,24.01 27.8,24.64 | 27.8,24.64 | 27.8,24.64 v27.73,24.71 | v21.44,10.43 20.23,10.43 R16.2
  Bottom 0.152: v21.44,10.43 21.44,15.04 19.49,16.99 19.49,17.5 19.85,17.85 21.55,17.85 27.73,24.03 v27.73,24.71
TXLED  (via drill 0.35)
  Top 0.152: U3.10 3.84,3.11 4.29,3.11 5.7,4.52 5.7,6.04 7.01,7.35 7.01,7.72 8.22,8.93 8.22,10.02 v8.23,10 | R14.1 10.62,9.06 10.62,9.86 v10.61,9.87
  Bottom 0.152: v8.23,10 10.48,10 v10.61,9.87
USB+  (via drill 0.35)
  Top 0.152: C16.1 13.92,2.66 12.33,2.66 | R12.1 12.48,2.81 12.33,2.66 | v7.03,6.3 7.03,2.4 7.9,1.52 11.2,1.52 12.33,2.66
  Bottom 0.152: USB1.3 4.97,6.01 5.8,6.01 6,6.21 7.03,6.21 v7.03,6.3
USB-  (via drill 0.35)
  Top 0.152: R11.1 12.41,4.25 | C15.2 12.21,4.85 12.21,4.25 12.41,4.25 | v6.35,5.41 6.35,1.92 7.15,1.12 14.29,1.12 14.86,1.69 14.86,3.5 14.11,4.25 12.41,4.25
  Bottom 0.152: USB1.2 6.32,5.24 6.42,5.33 v6.35,5.41
V_USB  (via drill 0.35)
  Top 0.152: U3.15 7.92,5.43 7.91,5.44 v7.73,5.44
  Bottom 0.152: v7.73,5.44 6.82,4.53 D2.+
  Bottom 0.406: USB1.1 6.45,4.59 D2.+
VIN  (via drill 0.35)
  Top 0.152: R3.2 6.48,30.19 C5.2 4.64,28.73 CHRG1.4 | LDO1.3 8.28,25.55 7.35,25.55 6.82,26.08 6.82,28.33
  Top 0.66: C5.2 6.07,28.54 6.12,28.48 | 6.12,28.48 v6.17,28.53 | 6.12,28.48 6.28,28.33 6.82,28.33 C6.2 9.04,28.33 LDO1.1
  Bottom 0.66: v6.17,28.53 6.17,20.63 5.79,20.25 5.79,15.91 11.47,10.23 11.47,5.93 8.57,3.03 8.57,2.11
  Bottom 0.711: D2.- 8.57,2.11 D1.-
VLIPO  (via drill 0.35)
  Top 0.152: R7.2 3.87,17.54 3.87,14.85 J1.2
  Top 0.66: CHRG1.3 3.48,24.72 C8.1 3.59,23.49 v3.3,23.2
  Bottom 0.66: 8.62,4.46 D1.+ 8.59,8.13 4.75,11.97 | v3.3,23.2 3.64,22.85 3.64,14.62 J1.2
  Bottom 0.711: D1.+ 8.6,4.44 | 4.75,11.97 3.65,13.07 J1.2

### Text on the board
tNames: - | +
bNames: - | +